# EAGLE schematic ShowerCop (EAGLE 9.6.2)
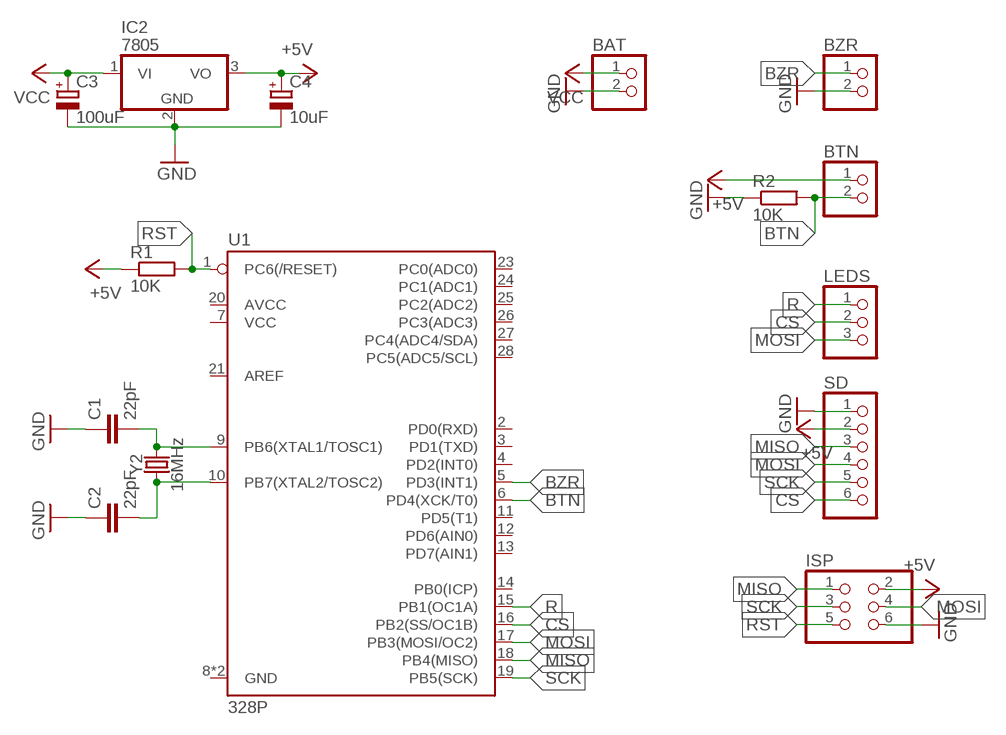
[diagram p0: schematic, sheet 1]

## Parts
BAT  PINHD-1X2  [1X02]
BTN  PINHD-1X2  [1X02]
BZR  PINHD-1X2  [1X02]
C1  22pF  22PF-PTH-2.54MM-200V-5%  [CAP-PTH-2.54]
C2  22pF  22PF-PTH-2.54MM-200V-5%  [CAP-PTH-2.54]
C3  100uF  CPOL-EUE2,5-6E  [E2,5-6E]
C4  10uF  CPOL-EUE2,5-6E  [E2,5-6E]
IC2  7805  7805TV  [TO220V]
ISP  PINHD-2X3  [2X03]
LEDS  PINHD-1X3  [1X03]
R1  10K  R-EU_0204/7  [0204/7]
R2  10K  R-EU_0204/7  [0204/7]
SD  PINHD-1X6  [1X06]
U1  328P  ATMEGA328P_PDIP  [DIP28]
Y2  16MHz  CRYSTAL-16MHZPTH-HC49US  [HC49US]

## Nets
+5V: BTN.1 C4.+ IC2.3(VO) ISP.2 R1.1 SD.2
BTN: BTN.2 R2.2 U1.6(PD4(XCK/T0))
BZR: BZR.1 U1.5(PD3(INT1))
CS: LEDS.2 SD.6 U1.16(PB2(SS/OC1B))
GND: BAT.2 BZR.2 C1.1 C2.1 C3.- C4.- IC2.2(GND) ISP.6 R2.1 SD.1
MISO: ISP.1 SD.3 U1.18(PB4(MISO))
MOSI: ISP.4 LEDS.3 SD.4 U1.17(PB3(MOSI/OC2))
N$1: C2.2 U1.10(PB7(XTAL2/TOSC2)) Y2.1
N$2: C1.2 U1.9(PB6(XTAL1/TOSC1)) Y2.2
R: LEDS.1 U1.15(PB1(OC1A))
RST: ISP.5 R1.2 U1.1(PC6(/RESET))
SCK: ISP.3 SD.5 U1.19(PB5(SCK))
VCC: BAT.1 C3.+ IC2.1(VI)
Unconnected: U1.2(PD0(RXD)) U1.3(PD1(TXD)) U1.4(PD2(INT0)) U1.7(VCC) U1.8(GND) U1.11(PD5(T1)) U1.12(PD6(AIN0)) U1.13(PD7(AIN1)) U1.14(PB0(ICP)) U1.20(AVCC) U1.21(AREF) U1.22(GND) U1.23(PC0(ADC0)) U1.24(PC1(ADC1)) U1.25(PC2(ADC2)) U1.26(PC3(ADC3)) U1.27(PC4(ADC4/SDA)) U1.28(PC5(ADC5/SCL))

## Library data of the parts
BAT BTN BZR = pinhead:PINHD-1X2: PIN HEADER
C1 C2 = SparkFun-Capacitors:22PF: 22pF ceramic capacitors A capacitor is a passive two-terminal electrical component used to store electrical energy temporarily in an electric field.; PROD_ID: CAP-09128
C3 C4 = rcl:CPOL-EU: POLARIZED CAPACITOR, European symbol; SPICEPREFIX: C
IC2 = linear:78*: Positive VOLTAGE REGULATOR Source: http://cache.national.com/ds/LM/LM78L05.pdf http://www.fairchildsemi.com/ds/LM/LM7805.pdf
ISP = pinhead:PINHD-2X3: PIN HEADER
LEDS = pinhead:PINHD-1X3: PIN HEADER
R1 R2 = rcl:R-EU_: RESISTOR, European symbol; SPICEPREFIX: R
SD = pinhead:PINHD-1X6: PIN HEADER
U1 = SparkFun-IC-Microcontroller:ATMEGA328P_PDIP: Atmel 328P Through hole ATMEGA328P uC used in the Arduino 32kb flash, 1k EEPROM, 2k SRAM Datasheet <http://www.sparkfun.com/datasheets/Components/SMD/ATMega328.pdf> SparkFun Products Storefront component: AVR 28 Pin 20MHz 32K 6A/D - ATMega328P <https://www.sparkfun.com/products/9061> (COM-09061) SparkFun Simon Says - Through-Hole Soldering Kit <https://www.sparkfun.com/products/10547> (KIT-10547) SparkFun Learn to Solder - Simon Says <https://www.sparkfun.com/products/13708> (KIT-13708) SparkFun BigTime Watch Kit <https://www.sparkfun.com/products/11734> (KIT-11734) SparkFun ClockIt <https://www.sparkfun.com/products/10930> (KIT-10930) SparkFun Serial Enabled LCD Kit <https://www.sparkfun.com/products/10097> (LCD-10097) SparkFun Simon Tilts - Through Hole Soldering Kit <https://www.sparkfun.com/products/12634> (KIT-12634) SparkFun Frequency Counter Kit <https://www.sparkfun.com/products/10140> (KIT-10140) FabFM Radio Kit <https://www.sparkfun.com/products/11043> (KIT-11043) SparkFun Binary Blaster Kit <https://www.sparkfun.com/products/12037> (KIT-12037) SparkFun Metro-Gnome <https://www.sparkfun.com/products/9236> (KIT-09236) ATmega328 with Arduino Optiboot (Uno) <https://www.sparkfun.com/products/10524> (DEV-10524); PROD_ID: IC-09136
Y2 = SparkFun-Clocks:CRYSTAL-16MHZ: 16MHz Crystal Digikey Example <http://www.digikey.com/product-search/en?keywords=535-9122-1-ND> Frequency: 16MHz Frequency Stability: ±50ppm Frequency Tolerance: ±20ppm Load Capacitance: 18pF SparkFun Products: Pro Micro -5V/16MHz <https://www.sparkfun.com/products/12640> SparkFun Serial Enabled LCD Kit <https://www.sparkfun.com/products/10097>; PROD_ID: XTAL-08181; SF_ID: COM-00536